# Altium project WS7.820.431.V01.PrjPCB
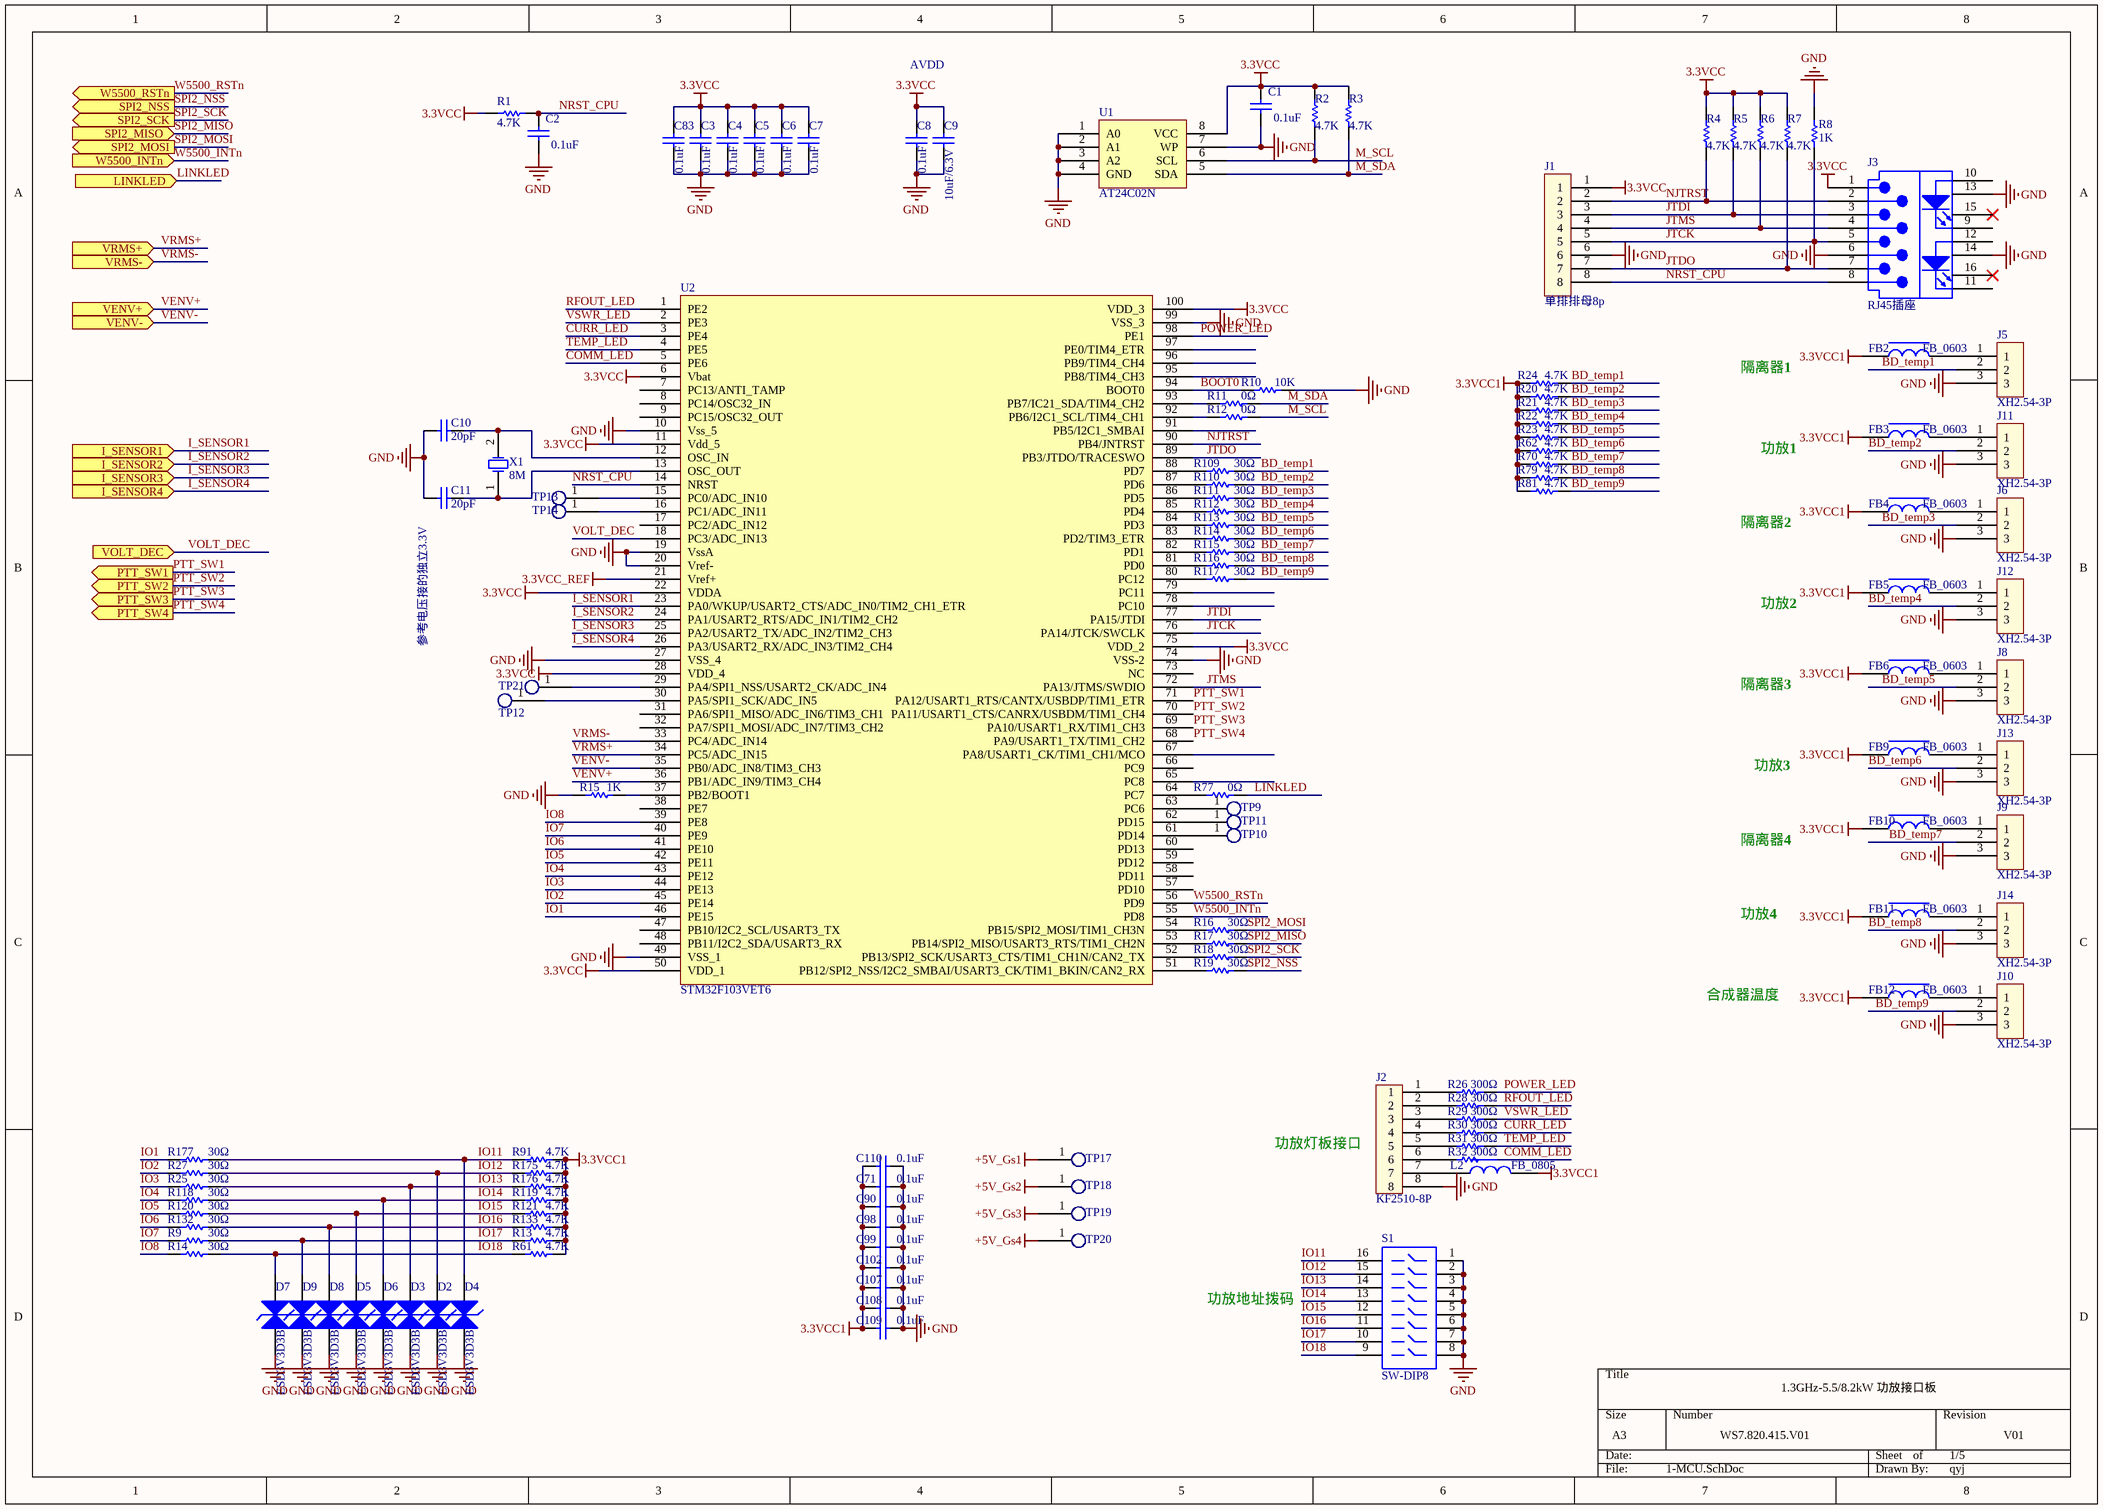
[diagram p0: 1-MCU.SchDoc]
4 sheets, 371 parts. Net scope: flat (ports and power ports of the same name join across sheets).
Board file: WS7.820.431.V01.PcbDoc
Sheets:
  1-MCU.SchDoc
  2-RJ45.SchDoc
  3-RF.SchDoc
  4-POWER.SchDoc

## Sheet 1-MCU.SchDoc
size A3

### Parts
C1  0.1uF  [C0603]
C2  0.1uF  [C0603]
C3  0.1uF  [C0603]
C4  0.1uF  [C0603]
C5  0.1uF  [C0603]
C6  0.1uF  [C0603]
C7  0.1uF  [C0603]
C8  0.1uF  [C0603]
C9  10uF/6.3V  [C0603]
C10  20pF  [C0603]
C11  20pF  [C0603]
C71  0.1uF  [C0603]
C83  0.1uF  [C0603]
C90  0.1uF  [C0603]
C98  0.1uF  [C0603]
C99  0.1uF  [C0603]
C102  0.1uF  [C0603]
C107  0.1uF  [C0603]
C108  0.1uF  [C0603]
C109  0.1uF  [C0603]
C110  0.1uF  [C0603]
D2  ESD3V3D3B  [SOD-323]
D3  ESD3V3D3B  [SOD-323]
D4  ESD3V3D3B  [SOD-323]
D5  ESD3V3D3B  [SOD-323]
D6  ESD3V3D3B  [SOD-323]
D7  ESD3V3D3B  [SOD-323]
D8  ESD3V3D3B  [SOD-323]
D9  ESD3V3D3B  [SOD-323]
FB2  FB_0603  [L0603]
FB3  FB_0603  [L0603]
FB4  FB_0603  [L0603]
FB5  FB_0603  [L0603]
FB6  FB_0603  [L0603]
FB9  FB_0603  [L0603]
FB10  FB_0603  [L0603]
FB11  FB_0603  [L0603]
FB12  FB_0603  [L0603]
J1  单排排母8p  [SIP8TM-2R54]
J2  KF2510-8P  [KF2510-8P -2R54-20R32x6R0-wanzhen]
J3  RJ45插座  [RJ45TH-1x1-2R54-LED]
J5  XH2.54-3P  [XH2.54mm-10R0x7R0--zhizhen]
J6  XH2.54-3P  [XH2.54mm-10R0x7R0--zhizhen]
J8  XH2.54-3P  [XH2.54mm-10R0x7R0--zhizhen]
J9  XH2.54-3P  [XH2.54mm-10R0x7R0--zhizhen]
J10  XH2.54-3P  [XH2.54mm-10R0x7R0--zhizhen]
J11  XH2.54-3P  [XH2.54mm-10R0x7R0--zhizhen]
J12  XH2.54-3P  [XH2.54mm-10R0x7R0--zhizhen]
J13  XH2.54-3P  [XH2.54mm-10R0x7R0--zhizhen]
J14  XH2.54-3P  [XH2.54mm-10R0x7R0--zhizhen]
L2  FB_0805  [L0805]
R1  4.7K  [R0603]
R2  4.7K  [R0603]
R3  4.7K  [R0603]
R4  4.7K  [R0603]
R5  4.7K  [R0603]
R6  4.7K  [R0603]
R7  4.7K  [R0603]
R8  1K  [R0603]
R9  30Ω  [R0603]
R10  10K  [R0603]
R11  0Ω  [R0603]
R12  0Ω  [R0603]
R13  4.7K  [R0603]
R14  30Ω  [R0603]
R15  1K  [R0603]
R16  30Ω  [R0603]
R17  30Ω  [R0603]
R18  30Ω  [R0603]
R19  30Ω  [R0603]
R20  4.7K  [R0603]
R21  4.7K  [R0603]
R22  4.7K  [R0603]
R23  4.7K  [R0603]
R24  4.7K  [R0603]
R25  30Ω  [R0603]
R26  300Ω  [R0603]
R27  30Ω  [R0603]
R28  300Ω  [R0603]
R29  300Ω  [R0603]
R30  300Ω  [R0603]
R31  300Ω  [R0603]
R32  300Ω  [R0603]
R61  4.7K  [R0603]
R62  4.7K  [R0603]
R70  4.7K  [R0603]
R77  0Ω  [R0603]
R79  4.7K  [R0603]
R81  4.7K  [R0603]
R91  4.7K  [R0603]
R109  30Ω  [R0603]
R110  30Ω  [R0603]
R111  30Ω  [R0603]
R112  30Ω  [R0603]
R113  30Ω  [R0603]
R114  30Ω  [R0603]
R115  30Ω  [R0603]
R116  30Ω  [R0603]
R117  30Ω  [R0603]
R118  30Ω  [R0603]
R119  4.7K  [R0603]
R120  30Ω  [R0603]
R121  4.7K  [R0603]
R132  30Ω  [R0603]
R133  4.7K  [R0603]
R175  4.7K  [R0603]
R176  4.7K  [R0603]
R177  30Ω  [R0603]
S1  SW-DIP8  [DIP-16-KEY]
TP9  TEST  [TP0R8]  (value not drawn)  (no BOM)
TP10  TEST  [TP0R8]  (value not drawn)  (no BOM)
TP11  TEST  [TP0R8]  (value not drawn)  (no BOM)
TP12  TEST  [TP0R8]  (value not drawn)  (no BOM)
TP13  TEST  [TP0R8]  (value not drawn)  (no BOM)
TP14  TEST  [TP0R8]  (value not drawn)  (no BOM)
TP17  (no value)  [TP2R54mm]
TP18  (no value)  [TP2R54mm]
TP19  (no value)  [TP2R54mm]
TP20  (no value)  [TP2R54mm]
TP21  TEST  [TP0R8]  (value not drawn)  (no BOM)
U1  AT24C02N  [SOIC8_1R27_3R9x4R9]
U2  STM32F103VET6  [LQFP100_0R5_14x14]
X1  8M  [CRY2SM-6R0x3R5]

### Ports
I_SENSOR1 (in), I_SENSOR2 (in), I_SENSOR3 (in), I_SENSOR4 (in), LINKLED (in), PTT_SW1 (out), PTT_SW2 (out), PTT_SW3 (out), PTT_SW4 (out), SPI2_MISO (in), SPI2_MOSI (out), SPI2_NSS (out), SPI2_SCK (out), VENV+ (in), VENV- (in), VOLT_DEC (in), VRMS+ (in), VRMS- (in), W5500_INTn (in), W5500_RSTn (out)

### Nets
3.3VCC: C1.2 C3.2 C4.2 C5.2 C6.2 C7.2 C8.2 C9.2 C83.2 J1.1 J3.1(TX+) R1.2 R2.2 R3.2 R4.2 R5.2 R6.2 R7.2 U1.8(VCC) U2.6(Vbat) U2.11(Vdd_5) U2.22(VDDA) U2.28(VDD_4) U2.50(VDD_1) U2.75(VDD_2) U2.100(VDD_3)
3.3VCC1: C71.1 C90.1 C98.1 C99.1 C102.1 C107.1 C108.1 C109.1 C110.1 FB2.1 FB3.1 FB4.1 FB5.1 FB6.1 FB9.1 FB10.1 FB11.1 FB12.1 L2.2 R13.1 R20.1 R21.1 R22.1 R23.1 R24.1 R61.1 R62.1 R70.1 R79.1 R81.1 R91.1 R119.1 R121.1 R133.1 R175.1 R176.1
3.3VCC_REF: U2.21(Vref+)
+5V_Gs1: TP17.1(TP)
+5V_Gs2: TP18.1(TP)
+5V_Gs3: TP19.1(TP)
+5V_Gs4: TP20.1(TP)
GND: C1.1 C2.1 C3.1 C4.1 C5.1 C6.1 C7.1 C8.1 C9.1 C10.2 C11.2 C71.2 C83.1 C90.2 C98.2 C99.2 C102.2 C107.2 C108.2 C109.2 C110.2 D2.2 D3.2 D4.2 D5.2 D6.2 D7.2 D8.2 D9.2 J1.6 J2.8 J3.6(RX-) J3.13 J3.14 J5.3 J6.3 J8.3 J9.3 J10.3 J11.3 J12.3 J13.3 J14.3 R8.1 R10.1 R15.1 S1.1 S1.2 S1.3 S1.4 S1.5 S1.6 S1.7 S1.8 U1.1(A0) U1.2(A1) U1.3(A2) U1.4(GND) U1.7(WP) U2.10(Vss_5) U2.19(VssA) U2.20(Vref-) U2.27(VSS_4) U2.49(VSS_1) U2.74(VSS-2) U2.99(VSS_3)
BD_temp1: J5.2 R24.2 R109.2
BD_temp2: J11.2 R20.2 R110.2
BD_temp3: J6.2 R21.2 R111.2
BD_temp4: J12.2 R22.2 R112.2
BD_temp5: J8.2 R23.2 R113.2
BD_temp6: J13.2 R62.2 R114.2
BD_temp7: J9.2 R70.2 R115.2
BD_temp8: J14.2 R79.2 R116.2
BD_temp9: J10.2 R81.2 R117.2
BOOT0: R10.2 U2.94(BOOT0)
COMM_LED: R32.2 U2.5(PE6)
CURR_LED: R30.2 U2.3(PE4)
I_SENSOR1: U2.23(PA0/WKUP/USART2_CTS/ADC_IN0/TIM2_CH1_ETR) ; port I_SENSOR1
I_SENSOR2: U2.24(PA1/USART2_RTS/ADC_IN1/TIM2_CH2) ; port I_SENSOR2
I_SENSOR3: U2.25(PA2/USART2_TX/ADC_IN2/TIM2_CH3) ; port I_SENSOR3
I_SENSOR4: U2.26(PA3/USART2_RX/ADC_IN3/TIM2_CH4) ; port I_SENSOR4
IO1: R177.2 U2.46(PE15)
IO2: R27.2 U2.45(PE14)
IO3: R25.2 U2.44(PE13)
IO4: R118.2 U2.43(PE12)
IO5: R120.2 U2.42(PE11)
IO6: R132.2 U2.41(PE10)
IO7: R9.2 U2.40(PE9)
IO8: R14.2 U2.39(PE8)
IO11: D4.1 R91.2 R177.1 S1.16
IO12: D2.1 R27.1 R175.2 S1.15
IO13: D3.1 R25.1 R176.2 S1.14
IO14: D6.1 R118.1 R119.2 S1.13
IO15: D5.1 R120.1 R121.2 S1.12
IO16: D8.1 R132.1 R133.2 S1.11
IO17: D9.1 R9.1 R13.2 S1.10
IO18: D7.1 R14.1 R61.2 S1.9
JTCK: J1.5 J3.5(NC) R8.2 U2.76(PA14/JTCK/SWCLK)
JTDI: J1.3 J3.3(RX+) R5.1 U2.77(PA15/JTDI)
JTDO: J1.7 J3.7(NC) R7.1 U2.89(PB3/JTDO/TRACESWO)
JTMS: J1.4 J3.4(NC) R6.1 U2.72(PA13/JTMS/SWDIO)
LINKLED: R77.2 ; port LINKLED
M_SCL: R2.1 R12.2 U1.6(SCL)
M_SDA: R3.1 R11.2 U1.5(SDA)
NJTRST: J1.2 J3.2(TX-) R4.1 U2.90(PB4/JNTRST)
NRST_CPU: C2.2 J1.8 J3.8(NC) R1.1 U2.14(NRST)
POWER_LED: R26.2 U2.98(PE1)
PTT_SW1: U2.71(PA12/USART1_RTS/CANTX/USBDP/TIM1_ETR) ; port PTT_SW1
PTT_SW2: U2.70(PA11/USART1_CTS/CANRX/USBDM/TIM1_CH4) ; port PTT_SW2
PTT_SW3: U2.69(PA10/USART1_RX/TIM1_CH3) ; port PTT_SW3
PTT_SW4: U2.68(PA9/USART1_TX/TIM1_CH2) ; port PTT_SW4
RFOUT_LED: R28.2 U2.1(PE2)
SPI2_MISO: R17.2 ; port SPI2_MISO
SPI2_MOSI: R16.2 ; port SPI2_MOSI
SPI2_NSS: R19.2 ; port SPI2_NSS
SPI2_SCK: R18.2 ; port SPI2_SCK
TEMP_LED: R31.2 U2.4(PE5)
VENV+: U2.36(PB1/ADC_IN9/TIM3_CH4) ; port VENV+
VENV-: U2.35(PB0/ADC_IN8/TIM3_CH3) ; port VENV-
VOLT_DEC: U2.18(PC3/ADC_IN13) ; port VOLT_DEC
VRMS+: U2.34(PC5/ADC_IN15) ; port VRMS+
VRMS-: U2.33(PC4/ADC_IN14) ; port VRMS-
VSWR_LED: R29.2 U2.2(PE3)
W5500_INTn: U2.55(PD8) ; port W5500_INTn
W5500_RSTn: U2.56(PD9) ; port W5500_RSTn
NetC10_1: C10.1 U2.12(OSC_IN) X1.2(OSC2)
NetC11_1: C11.1 U2.13(OSC_OUT) X1.1(OSC1)
NetFB2_2: FB2.2 J5.1
NetFB3_2: FB3.2 J11.1
NetFB4_2: FB4.2 J6.1
NetFB5_2: FB5.2 J12.1
NetFB6_2: FB6.2 J8.1
NetFB9_2: FB9.2 J13.1
NetFB10_2: FB10.2 J9.1
NetFB11_2: FB11.2 J14.1
NetFB12_2: FB12.2 J10.1
NetJ2_1: J2.1 R26.1
NetJ2_2: J2.2 R28.1
NetJ2_3: J2.3 R29.1
NetJ2_4: J2.4 R30.1
NetJ2_5: J2.5 R31.1
NetJ2_6: J2.6 R32.1
NetJ2_7: J2.7 L2.1
NetR11_1: R11.1 U2.93(PB7/IC21_SDA/TIM4_CH2)
NetR12_1: R12.1 U2.92(PB6/I2C1_SCL/TIM4_CH1)
NetR15_2: R15.2 U2.37(PB2/BOOT1)
NetR16_1: R16.1 U2.54(PB15/SPI2_MOSI/TIM1_CH3N)
NetR17_1: R17.1 U2.53(PB14/SPI2_MISO/USART3_RTS/TIM1_CH2N)
NetR18_1: R18.1 U2.52(PB13/SPI2_SCK/USART3_CTS/TIM1_CH1N/CAN2_TX)
NetR19_1: R19.1 U2.51(PB12/SPI2_NSS/I2C2_SMBAI/USART3_CK/TIM1_BKIN/CAN2_RX)
NetR77_1: R77.1 U2.64(PC7)
NetR109_1: R109.1 U2.88(PD7)
NetR110_1: R110.1 U2.87(PD6)
NetR111_1: R111.1 U2.86(PD5)
NetR112_1: R112.1 U2.85(PD4)
NetR113_1: R113.1 U2.84(PD3)
NetR114_1: R114.1 U2.83(PD2/TIM3_ETR)
NetR115_1: R115.1 U2.82(PD1)
NetR116_1: R116.1 U2.81(PD0)
NetR117_1: R117.1 U2.80(PC12)
NetTP9_1: TP9.1(TP) U2.63(PC6)
NetTP10_1: TP10.1(TP) U2.61(PD14)
NetTP11_1: TP11.1(TP) U2.62(PD15)
NetTP12_1: TP12.1(TP) U2.30(PA5/SPI1_SCK/ADC_IN5)
NetTP13_1: TP13.1(TP) U2.15(PC0/ADC_IN10)
NetTP14_1: TP14.1(TP) U2.16(PC1/ADC_IN11)
NetTP21_1: TP21.1(TP) U2.29(PA4/SPI1_NSS/USART2_CK/ADC_IN4)

Not connected (* = marked no-connect by the designer): J3 9(K1) 10(A1) 11(K2) 12(A2) 15* 16*; U2 7(PC13/ANTI_TAMP) 8(PC14/OSC32_IN) 9(PC15/OSC32_OUT) 17(PC2/ADC_IN12) 31(PA6/SPI1_MISO/ADC_IN6/TIM3_CH1) 32(PA7/SPI1_MOSI/ADC_IN7/TIM3_CH2) 38(PE7) 47(PB10/I2C2_SCL/USART3_TX) 48(PB11/I2C2_SDA/USART3_RX) 57(PD10) 58(PD11) 59(PD12) 60(PD13) 65(PC8) 66(PC9) 67(PA8/USART1_CK/TIM1_CH1/MCO) 73(NC) 78(PC10) 79(PC11) 91(PB5/I2C1_SMBAI) 95(PB8/TIM4_CH3) 96(PB9/TIM4_CH4) 97(PE0/TIM4_ETR)

### Notes on the sheet
- AVDD
- 隔离器1
- 功放1
- 隔离器2
- 参考电压接的独立3.3V
- 功放2
- 隔离器3
- 功放3
- 隔离器4
- 功放4
- 合成器温度
- 功放灯板接口
- 功放地址拨码
- 1.3GHz-5.5/8.2kW 功放接口板
- WS7.820.415.V01
- 1/5
- V01
- qyj

### Library data of the parts
C1-C8 C83 = 0.1uF贴片电容: 贴片电容_GRM188R71H104KA01D_0.1uF±10%,50V,0603; code: 01010045
C9 = 10uF贴片电容: 贴片电容_GRM188R60J106ME47D_10uF±20%,6.3V,0603; code: 01010037
C10 C11 = 20pF贴片电容: 贴片电容_GRM188C1H200JB01D_20pF±5%,50V,0603; code: 01010035
C71 C90 C98 C99 C102 C107-C110 = 0.1uF: GRM188R71H104KA01D; MPN: MURATA; WSPN: 01010045
D2-D9 = ESD5B5.0ST1G: ESD_ESD3V3D3B_SOD-323,3.3V,双管
FB2-FB6 FB9-FB12 = 0603贴片磁珠: 贴片磁珠_100R,0603; code: 0103016
J1 = 8p-2.54单排母座: 连接器_单排排母座8p_直插,间距2.54mm; MPN: WS; code: 01090052
J2 = KF2510-8P弯针: 连接器_KF2510-8P_90°弯针,间距2.54mm
J3 = RJ45弯脚带灯: RJ45插座_1*1,带左黄右绿灯,弯脚; MPN: 朱迅; code: 01090042
J5 J6 J8-J14 = XH2.54-3P: 连接器_XH2.54-3P_弯针,间距2.54mm
L2 = 0805贴片磁珠: 贴片磁珠_600R,0805; code: 01030023
R1-R7 R13 R20-R24 R61 R62 R70 R79 R81 R91 R119 R121 R133 R175 R176 = 4.7K贴片电阻: 贴片电阻_4.7K±5%,0603; code: 01020012
R8 R15 = 1K贴片电阻: 贴片电阻_1K±5%,0603; code: 01020082
R9 R14 R25 R27 R118 R120 R132 R177 = 0Ω贴片电阻: 贴片电阻_30Ω±5%,0603; code: 01020010
R10 = 10K贴片电阻: 贴片电阻_10K±5%,0603; code: 01020011
R11 R12 R77 = 0Ω贴片电阻: 贴片电阻_0Ω±5%,0603; code: 01020010
R16-R19 R109-R117 = 30Ω贴片电阻: 贴片电阻_30Ω±5%,0603; code: 01020108
R26 R28-R32 = 300Ω贴片电阻: 贴片电阻_300Ω±5%,0603; code: 01020008
S1 = SW-DIP8: 4009 Series DIP Switch, Raised actuator; Published: 24-Mar-1999; LatestRevisionDate: 17-Dec-2003; LatestRevisionNote: PCB Footprint replaced.; PackageReference: DIP-16-KEY; Publisher: Altium Limited; PackageDescription: DIP; 16 Leads; Row Spacing 7.62 mm; Pitch 2.54 mm; ComponentLink1Description: Manufacturer Link; ComponentLink1URL: http://www.oupiin.com/prodindx.html#Headers
TP9-TP14 TP21 = TP0.8mm: 表贴测试点0.8mm
TP17-TP20 = TP2mm: 表贴测试点1mm
U1 = AT24C02N: EEPROM_AT24C02N_SOIC8; Maker: ATMEL; code: 01060068
U2 = STM32F103VET: MCU_STM32F103VET6_32 bit, LQFP100; Maker: ST; code: 01060037
X1 = 8M贴片无源晶体: 贴片无源晶体_8MHz,封装6035; code: 03050006

## Sheet 2-RJ45.SchDoc
size A3
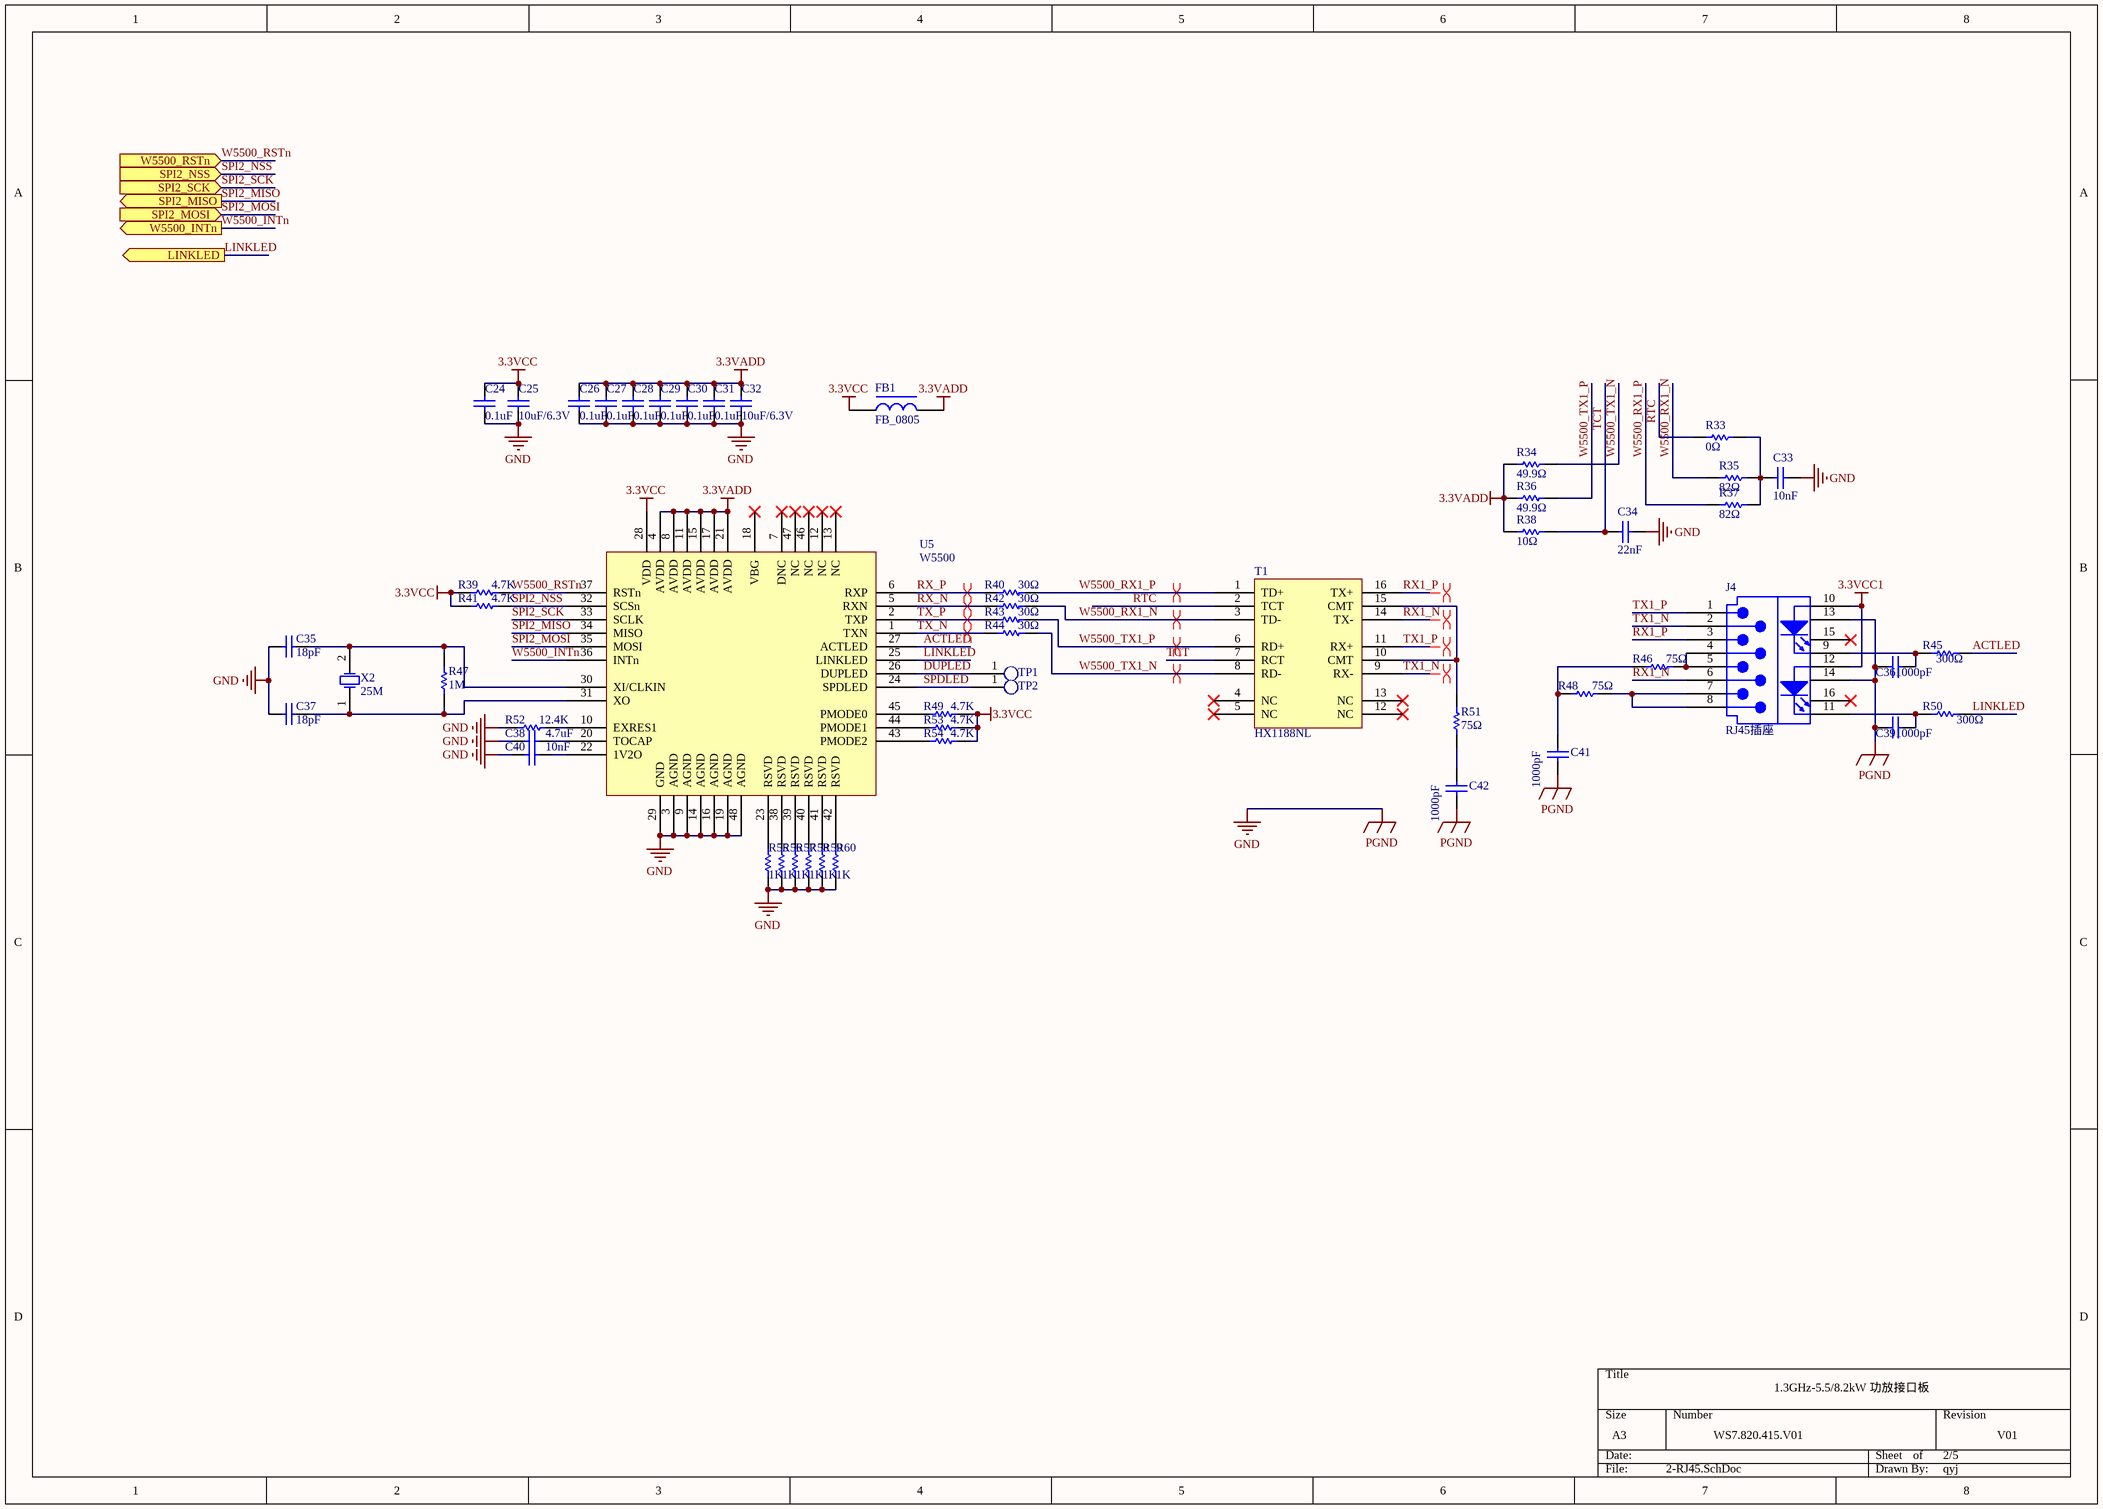
[diagram p1: 2-RJ45.SchDoc]

### Parts
C24  0.1uF  [C0603]
C25  10uF/6.3V  [C0603]
C26  0.1uF  [C0603]
C27  0.1uF  [C0603]
C28  0.1uF  [C0603]
C29  0.1uF  [C0603]
C30  0.1uF  [C0603]
C31  0.1uF  [C0603]
C32  10uF/6.3V  [C0603]
C33  10nF  [C0603]
C34  22nF  [C0603]
C35  18pF  [C0603]
C36  1000pF  [C0603]
C37  18pF  [C0603]
C38  4.7uF  [C0603]
C39  1000pF  [C0603]
C40  10nF  [C0603]
C41  1000pF  [C1206]
C42  1000pF  [C1206]
FB1  FB_0805  [L0805]
J4  RJ45插座  [RJ45TH-1x1-2R54-LED]
R33  0Ω  [R0603]
R34  49.9Ω  [R0603]
R35  82Ω  [R0603]
R36  49.9Ω  [R0603]
R37  82Ω  [R0603]
R38  10Ω  [R0603]
R39  4.7K  [R0603]
R40  30Ω  [R0603]
R41  4.7K  [R0603]
R42  30Ω  [R0603]
R43  30Ω  [R0603]
R44  30Ω  [R0603]
R45  300Ω  [R0603]
R46  75Ω  [R0805]
R47  1M  [R0603]
R48  75Ω  [R0805]
R49  4.7K  [R0603]
R50  300Ω  [R0603]
R51  75Ω  [R1206]
R52  12.4K  [R0603]
R53  4.7K  [R0603]
R54  4.7K  [R0603]
R55  1K  [R0603]
R56  1K  [R0603]
R57  1K  [R0603]
R58  1K  [R0603]
R59  1K  [R0603]
R60  1K  [R0603]
T1  HX1188NL  [SOP16-1R27-7R11x12R7]
TP1  TEST  [TP0R8]  (value not drawn)
TP2  TEST  [TP0R8]  (value not drawn)
U5  W5500  [TQFN48-0R5-7X7]
X2  25M  [CRY2SM-6R0x3R5]

### Ports
LINKLED (out), SPI2_MISO (out), SPI2_MOSI (in), SPI2_NSS (in), SPI2_SCK (in), W5500_INTn (out), W5500_RSTn (in)

### Nets
3.3VADD: C26.2 C27.2 C28.2 C29.2 C30.2 C31.2 C32.2 FB1.2 R34.2 R36.2 R38.2 U5.4(AVDD) U5.8(AVDD) U5.11(AVDD) U5.15(AVDD) U5.17(AVDD) U5.21(AVDD)
3.3VCC: C24.2 C25.2 FB1.1 R39.2 R41.2 R49.2 R53.2 R54.2 U5.28(VDD)
3.3VCC1: J4.10(A1) J4.12(A2)
GND: C24.1 C25.1 C26.1 C27.1 C28.1 C29.1 C30.1 C31.1 C32.1 C33.1 C34.1 C35.1 C36.1 C37.1 C38.1 C39.1 C40.1 C41.1 C42.1 J4.13 J4.14 R52.1 R55.1 R56.1 R57.1 R58.1 R59.1 R60.1 U5.3(AGND) U5.9(AGND) U5.14(AGND) U5.16(AGND) U5.19(AGND) U5.29(GND) U5.48(AGND)  [also labelled PGND]
ACTLED: R45.2 U5.27(ACTLED)
DUPLED: TP1.1(TP) U5.26(DUPLED)
LINKLED: R50.2 U5.25(LINKLED) ; port LINKLED
RTC: R33.2 T1.2(TCT)
RX1_N: J4.6(RX-) T1.14(TX-)
RX1_P: J4.3(RX+) T1.16(TX+)
RX_N: R42.1 U5.5(RXN)
RX_P: R40.1 U5.6(RXP)
SPDLED: TP2.1(TP) U5.24(SPDLED)
SPI2_MISO: U5.34(MISO) ; port SPI2_MISO
SPI2_MOSI: U5.35(MOSI) ; port SPI2_MOSI
SPI2_NSS: R41.1 U5.32(SCSn) ; port SPI2_NSS
SPI2_SCK: U5.33(SCLK) ; port SPI2_SCK
TCT: C34.2 R38.1 T1.7(RCT)
TX1_N: J4.2(TX-) T1.9(RX-)
TX1_P: J4.1(TX+) T1.11(RX+)
TX_N: R44.1 U5.1(TXN)
TX_P: R43.1 U5.2(TXP)
W5500_INTn: U5.36(INTn) ; port W5500_INTn
W5500_RSTn: R39.1 U5.37(RSTn) ; port W5500_RSTn
W5500_RX1_N: R35.2 R42.2 T1.3(TD-)
W5500_RX1_P: R37.2 R40.2 T1.1(TD+)
W5500_TX1_N: R34.1 R44.2 T1.8(RD-)
W5500_TX1_P: R36.1 R43.2 T1.6(RD+)
NetC33_2: C33.2 R33.1 R35.1 R37.1
NetC35_2: C35.2 R47.2 U5.30(XI/CLKIN) X2.2(OSC2)
NetC36_2: C36.2 J4.9(K1) R45.1
NetC37_2: C37.2 R47.1 U5.31(XO) X2.1(OSC1)
NetC38_2: C38.2 U5.20(TOCAP)
NetC39_2: C39.2 J4.11(K2) R50.1
NetC40_2: C40.2 U5.22(1V2O)
NetC41_2: C41.2 R46.1 R48.1
NetC42_2: C42.2 R51.1
NetJ4_4: J4.4(NC) J4.5(NC) R46.2
NetJ4_7: J4.7(NC) J4.8(NC) R48.2
NetR49_1: R49.1 U5.45(PMODE0)
NetR51_2: R51.2 T1.10(CMT) T1.15(CMT)
NetR52_2: R52.2 U5.10(EXRES1)
NetR53_1: R53.1 U5.44(PMODE1)
NetR54_1: R54.1 U5.43(PMODE2)
NetR55_2: R55.2 U5.23(RSVD)
NetR56_2: R56.2 U5.38(RSVD)
NetR57_2: R57.2 U5.39(RSVD)
NetR58_2: R58.2 U5.40(RSVD)
NetR59_2: R59.2 U5.41(RSVD)
NetR60_2: R60.2 U5.42(RSVD)

Not connected (* = marked no-connect by the designer): J4 15* 16*; T1 4(NC)* 5(NC)* 12(NC)* 13(NC)*; U5 7(DNC)* 12(NC)* 13(NC)* 18(VBG)* 46(NC)* 47(NC)*

### Layout directives
differential pair: RX1_N, RX1_P, RX_N, RX_P, TX1_N, TX1_P, TX_N, TX_P, W5500_RX1_N, W5500_RX1_P, W5500_TX1_N, W5500_TX1_P

### Notes on the sheet
- 1.3GHz-5.5/8.2kW 功放接口板
- WS7.820.415.V01
- 2/5
- V01
- qyj

### Library data of the parts
C24 C26-C31 = 0.1uF贴片电容: as C1 on sheet 1-MCU
C25 C32 = 10uF贴片电容: as C9 on sheet 1-MCU
C33 C40 = 0.1uF贴片电容: C0603C103K5RAC_10nF±10%,50V,0603; MPN: KEMET; code: 01010218
C34 = 27nF贴片电容: 贴片电容_22nF±5%,50V,0603; code: 01010054
C35 C37 = 18pF贴片电容: 贴片电容_GRM1885C1H180JA01D_18pF±5%,50V,0603; code: 01010102
C36 C39 = 1000pF贴片电容: 贴片电容_GRM188R71H102KA01_1000pF±10%,50V,0603; code: 01010093
C38 = 1uF贴片电容: GRM188R61C475K_4.7uF±10%,16V,0603; MPN: Murata; code: 01010098
C41 C42 = 10uF贴片电容: 贴片电容_C1206C102J5GAC _1000pF±5%,50V,1206; MPN: KEMET; code: 01010213
FB1 = 0805贴片磁珠: 贴片磁珠_600R,0805; code: 01030023
J4 = RJ45弯脚带灯: as J3 on sheet 1-MCU
R33 = 0Ω贴片电阻: 贴片电阻_0Ω±5%,0603; code: 01020010
R34 R36 = 51Ω贴片电阻: 贴片电阻_49.9Ω±1%,0603; code: 01020126
R35 R37 = 51Ω贴片电阻: 贴片电阻_82Ω±1%,0603; code: 01020196
R38 = 10Ω贴片电阻: 贴片电阻_10Ω±5%,0603; code: 01020104
R39 R41 R49 R53 R54 = 4.7K贴片电阻: 贴片电阻_4.7K±5%,0603; code: 01020012
R40 R42-R44 = 30Ω贴片电阻: 贴片电阻_30Ω±5%,0603; code: 01020108
R45 R50 = 300Ω贴片电阻: 贴片电阻_300Ω±5%,0603; code: 01020008
R46 R48 = 75Ω贴片电阻: 贴片电阻_75Ω±5%,0805; code: 01020068
R47 = 1M贴片电阻: 贴片电阻_1M±5%,0603; code: 01020093
R51 = 75Ω贴片电阻: 贴片电阻_75Ω±5%,1206; code: 01020197
R52 = 12K贴片电阻: 贴片电阻_12.4K±1%,0603
R55-R60 = 1K贴片电阻: 贴片电阻_1K±5%,0603; code: 01020082
T1 = HX1188NL: 网络变压器_HX1188NL_百兆,SOIC16; code: 01060114
TP1 TP2 = TP0.8mm: 表贴测试点0.8mm
U5 = W5500: 以太网控制器_W5500_LQFP48; code: 01060113
X2 = 25M贴片无源晶体: 贴片无源晶体_25MHz,30ppm,6035封装; code: 03050012

## Sheet 3-RF.SchDoc
size A2
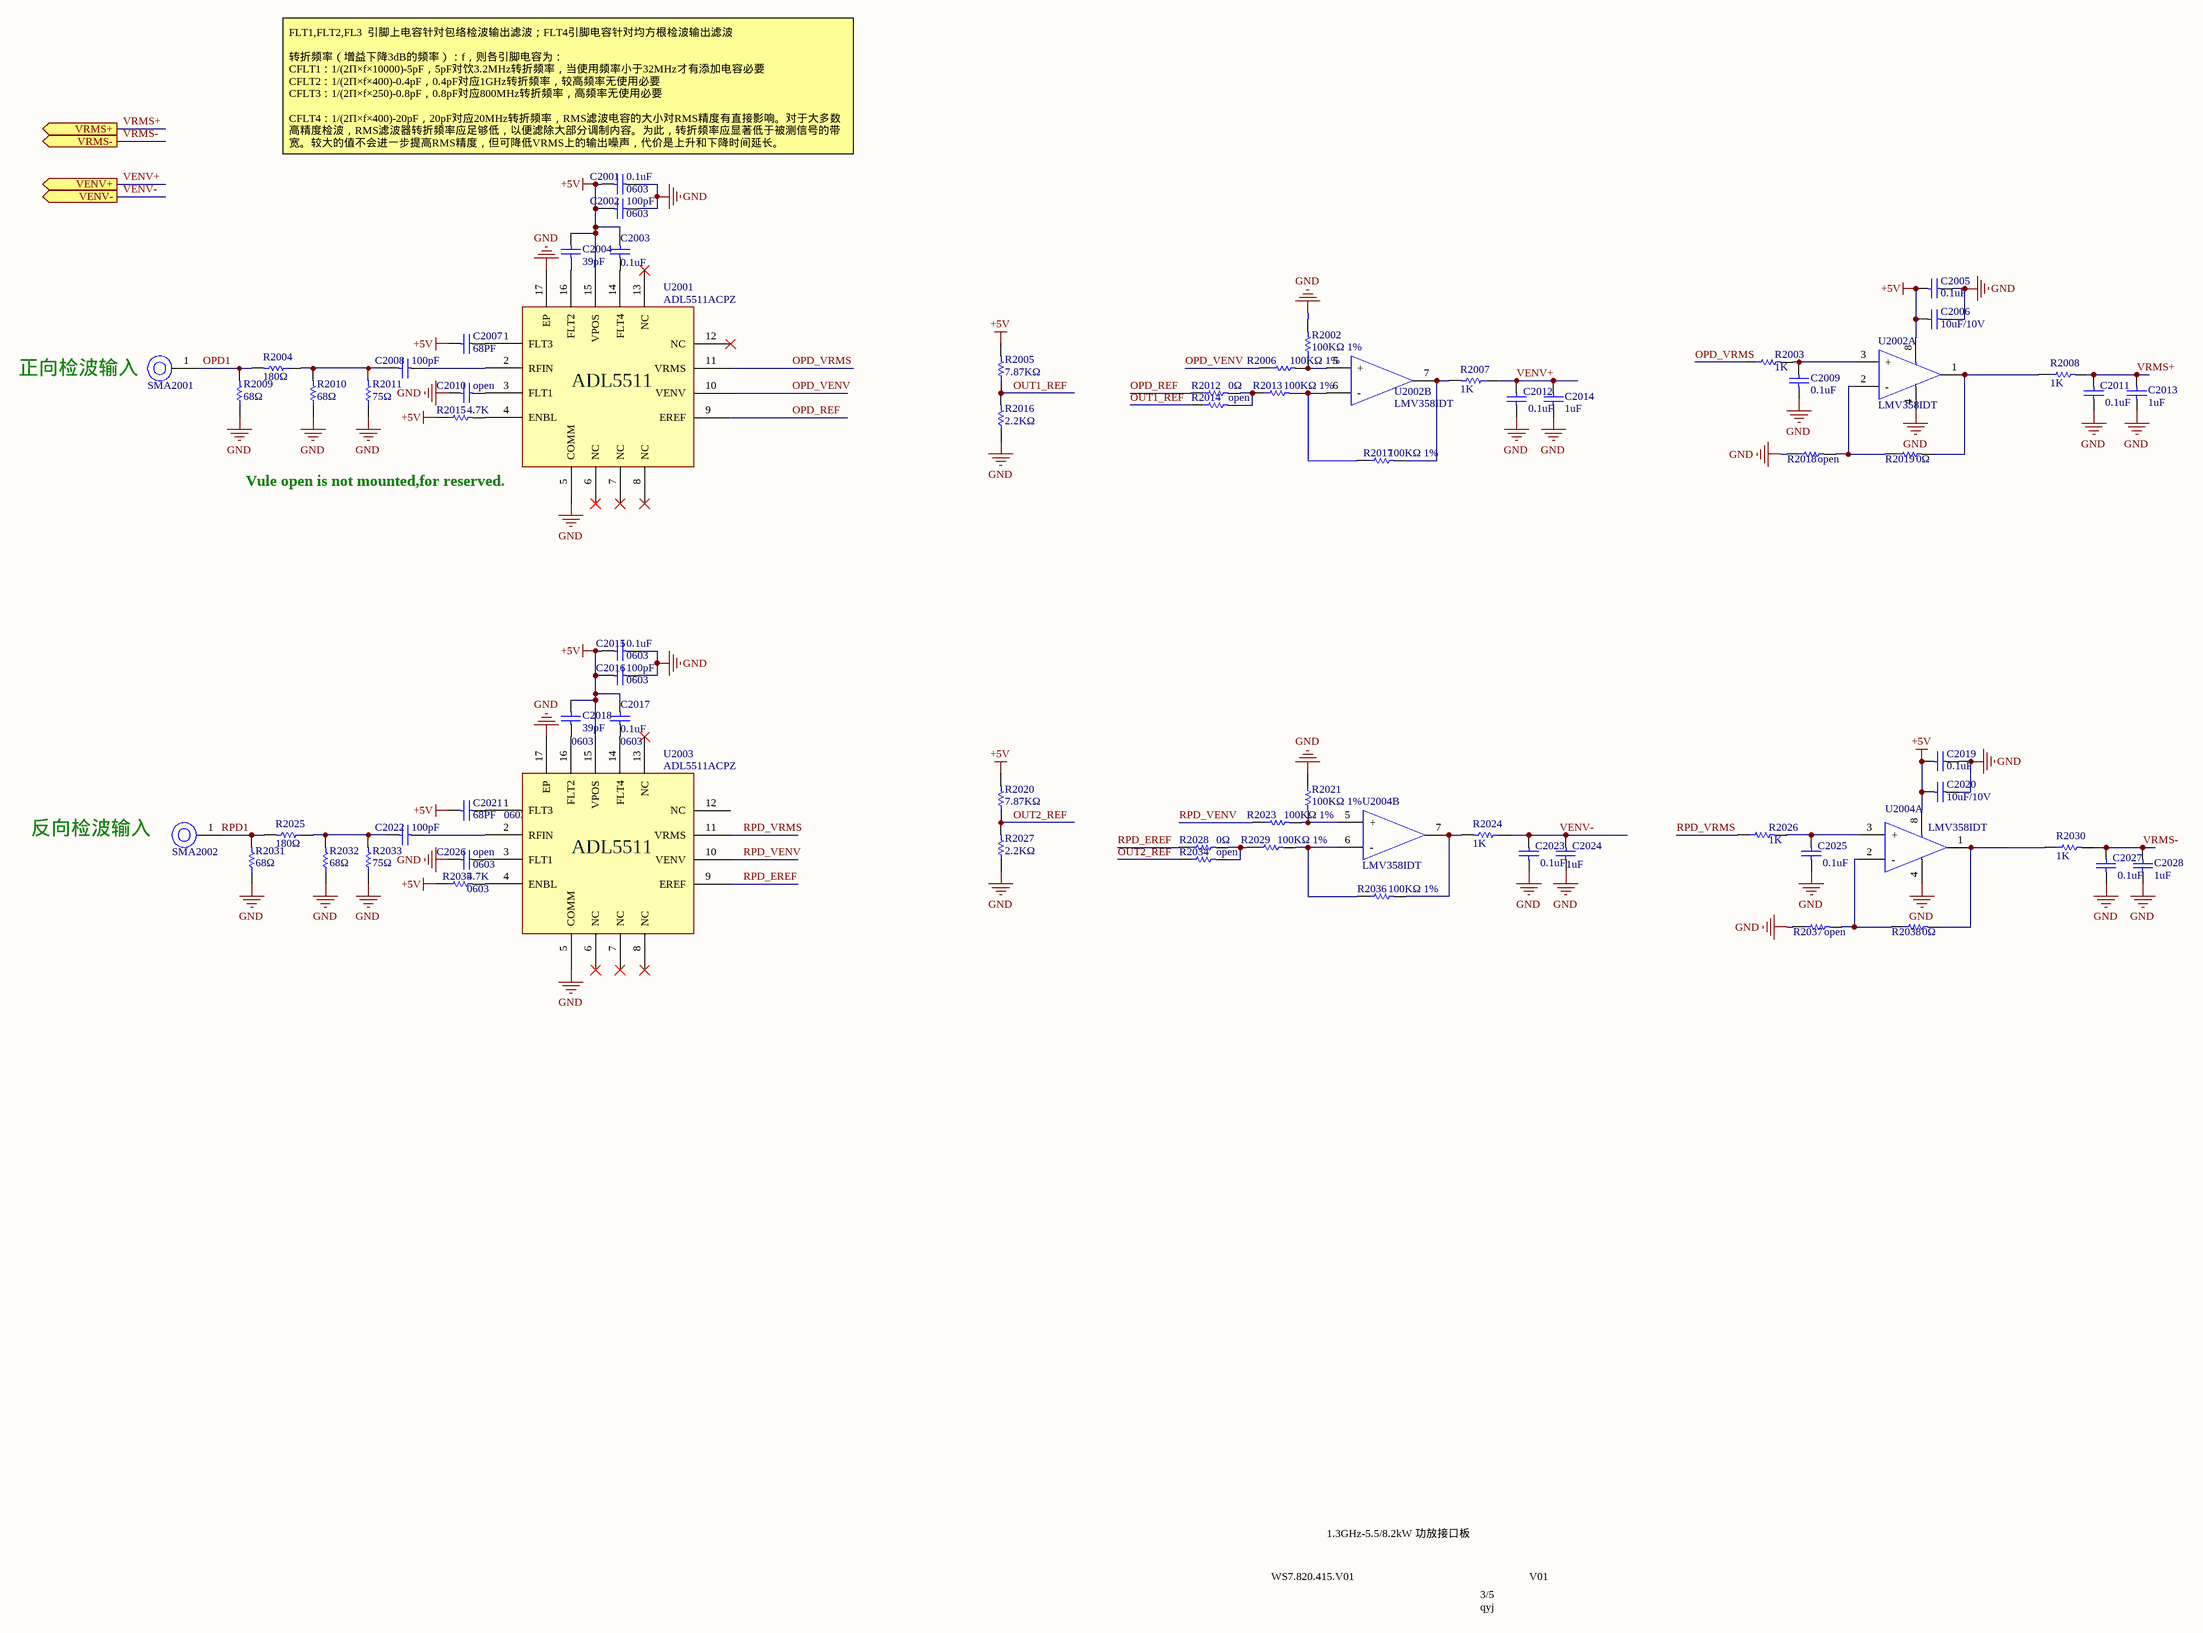
[diagram p2: 3-RF.SchDoc]

### Parts
C2001  0.1uF  [C0603]
C2002  100pF  [C0603]
C2003  0.1uF  [C0603]
C2004  39pF  [C0603]  (no BOM)
C2005  0.1uF  [C0603]
C2006  10uF/10V  [C0805]
C2007  68PF  [C0603]  (no BOM)
C2008  100pF  [C0805]
C2009  0.1uF  [C0603]
C2010  open  [C0603]  (no BOM)
C2011  0.1uF  [C0603]
C2012  0.1uF  [C0603]
C2013  1uF  [C0603]
C2014  1uF  [C0603]
C2015  0.1uF  [C0603]
C2016  100pF  [C0603]
C2017  0.1uF  [C0603]
C2018  39pF  [C0603]  (no BOM)
C2019  0.1uF  [C0603]
C2020  10uF/10V  [C0805]
C2021  68PF  [C0603]  (no BOM)
C2022  100pF  [C0805]
C2023  0.1uF  [C0603]
C2024  1uF  [C0603]
C2025  0.1uF  [C0603]
C2026  open  [C0603]  (no BOM)
C2027  0.1uF  [C0603]
C2028  1uF  [C0603]
R2002  100KΩ 1%  [R0603]
R2003  1K  [R0603]
R2004  180Ω  [R1206]
R2005  7.87KΩ  [R0603]  (no BOM)
R2006  100KΩ 1%  [R0603]
R2007  1K  [R0603]
R2008  1K  [R0603]
R2009  68Ω  [R1206]
R2010  68Ω  [R1206]
R2011  75Ω  [R0805]
R2012  0Ω  [R0603]
R2013  100KΩ 1%  [R0603]
R2014  open  [R0603]  (no BOM)
R2015  4.7K  [R0603]
R2016  2.2KΩ  [R0603]  (no BOM)
R2017  100KΩ 1%  [R0603]
R2018  open  [R0603]  (no BOM)
R2019  0Ω  [R0603]
R2020  7.87KΩ  [R0603]  (no BOM)
R2021  100KΩ 1%  [R0603]
R2023  100KΩ 1%  [R0603]
R2024  1K  [R0603]
R2025  180Ω  [R1206]
R2026  1K  [R0603]
R2027  2.2KΩ  [R0603]  (no BOM)
R2028  0Ω  [R0603]
R2029  100KΩ 1%  [R0603]
R2030  1K  [R0603]
R2031  68Ω  [R1206]
R2032  68Ω  [R1206]
R2033  75Ω  [R0805]
R2034  open  [R0603]  (no BOM)
R2035  4.7K  [R0603]
R2036  100KΩ 1%  [R0603]
R2037  open  [R0603]  (no BOM)
R2038  0Ω  [R0603]
SMA2001  SMA-50KFD-4  [SMA-50KFD-4]  (value not drawn)
SMA2002  SMA-50KFD-4  [SMA-50KFD-4]  (value not drawn)
U2001  ADL5511ACPZ  [QFN16_0R50_3X3]
U2002  LMV358IDT  [SOIC8_1R27_3R9x4R9]  (parts A,B of 2)
U2003  ADL5511ACPZ  [QFN16_0R50_3X3]
U2004  LMV358IDT  [SOIC8_1R27_3R9x4R9]  (parts A,B of 2)

### Ports
VENV+ (out), VENV- (out), VRMS+ (out), VRMS- (out)

### Nets
+5V: C2001.2 C2002.1 C2003.2 C2004.2 C2005.1 C2006.1 C2007.1 C2015.2 C2016.1 C2017.2 C2018.2 C2019.1 C2020.1 C2021.1 R2005.2 R2015.1 R2020.2 R2035.1 U2001.15(VPOS) U2002.8 U2003.15(VPOS) U2004.8
GND: C2001.1 C2002.2 C2005.2 C2006.2 C2009.1 C2010.1 C2011.1 C2012.1 C2013.1 C2014.1 C2015.1 C2016.2 C2019.2 C2020.2 C2023.1 C2024.1 C2025.1 C2026.1 C2027.1 C2028.1 R2002.2 R2009.1 R2010.1 R2011.1 R2016.1 R2018.1 R2021.1 R2027.1 R2031.1 R2032.1 R2033.1 R2037.1 U2001.5(COMM) U2001.17(EP) U2002.4 U2003.5(COMM) U2003.17(EP) U2004.4
OPD1: R2004.2 R2009.2 SMA2001.1(Sig)
OPD_REF: R2012.1 U2001.9(EREF)
OPD_VENV: R2006.1 U2001.10(VENV)
OPD_VRMS: R2003.1 U2001.11(VRMS)
OUT1_REF: R2005.1 R2014.1 R2016.2
OUT2_REF: R2020.1 R2027.2 R2034.1
RPD1: R2025.2 R2031.2 SMA2002.1(Sig)
RPD_EREF: R2028.1 U2003.9(EREF)
RPD_VENV: R2023.1 U2003.10(VENV)
RPD_VRMS: R2026.1 U2003.11(VRMS)
VENV+: C2012.2 C2014.2 R2007.1 ; port VENV+
VENV-: C2023.2 C2024.2 R2024.1 ; port VENV-
VRMS+: C2011.2 C2013.2 R2008.2 ; port VRMS+
VRMS-: C2027.2 C2028.2 R2030.2 ; port VRMS-
NetC2003_1: C2003.1 U2001.14(FLT4)
NetC2004_1: C2004.1 U2001.16(FLT2)
NetC2007_2: C2007.2 U2001.1(FLT3)
NetC2008_1: C2008.1 R2004.1 R2010.2 R2011.2
NetC2008_2: C2008.2 U2001.2(RFIN)
NetC2009_2: C2009.2 R2003.2 U2002.3(+)
NetC2010_2: C2010.2 U2001.3(FLT1)
NetC2017_1: C2017.1 U2003.14(FLT4)
NetC2018_1: C2018.1 U2003.16(FLT2)
NetC2021_2: C2021.2 U2003.1(FLT3)
NetC2022_1: C2022.1 R2025.1 R2032.2 R2033.2
NetC2022_2: C2022.2 U2003.2(RFIN)
NetC2025_2: C2025.2 R2026.2 U2004.3(+)
NetC2026_2: C2026.2 U2003.3(FLT1)
NetR2002_1: R2002.1 R2006.2 U2002.5(+)
NetR2007_2: R2007.2 R2017.2 U2002.7
NetR2008_1: R2008.1 R2019.2 U2002.1
NetR2012_2: R2012.2 R2013.1 R2014.2
NetR2013_2: R2013.2 R2017.1 U2002.6(-)
NetR2015_2: R2015.2 U2001.4(ENBL)
NetR2018_2: R2018.2 R2019.1 U2002.2(-)
NetR2021_2: R2021.2 R2023.2 U2004.5(+)
NetR2024_2: R2024.2 R2036.2 U2004.7
NetR2028_2: R2028.2 R2029.1 R2034.2
NetR2029_2: R2029.2 R2036.1 U2004.6(-)
NetR2030_1: R2030.1 R2038.2 U2004.1
NetR2035_2: R2035.2 U2003.4(ENBL)
NetR2037_2: R2037.2 R2038.1 U2004.2(-)

Not connected (* = marked no-connect by the designer): U2001 6(NC)* 7(NC)* 8(NC)* 12(NC)* 13(NC)*; U2003 6(NC)* 7(NC)* 8(NC)* 12(NC) 13(NC)*

### Notes on the sheet
- (near C2001) FLT1,FLT2,FL3  引脚上电容针对包络检波输出滤波；FLT4引脚电容针对均方根检波输出滤波
  转折频率（增益下降3dB的频率）：f，则各引脚电容为：
  CFLT1：1/(2Π×f×10000)-5pF，5pF对饮3.2MHz转折频率，当使用频率小于32MHz才有添加电容必要
  CFLT2：1/(2Π×f×400)-0.4pF，0.4pF对应1GHz转折频率，较高频率无使用必要
  CFLT3：1/(2Π×f×250)-0.8pF，0.8pF对应800MHz转折频率，高频率无使用必要
  CFLT4：1/(2Π×f×400)-20pF，20pF对应20MHz转折频率，RMS滤波电容的大小对RMS精度有直接影响。对于大多数高精度检波，RMS滤波器转折频率应足够低，以便滤除大部分调制内容。为此，转折频率应显著低于被测信号的带宽。较大的值不会进一步提高RMS精度，但可降低VRMS上的输出噪声，代价是上升和下降时间延长。
- (near C2001) 0603
- (near C2002) 0603
- 正向检波输入
- (near U2001) Vule open is not mounted,for reserved.
- (near C2015) 0603
- (near C2016) 0603
- (near C2018) 0603
- (near C2017) 0603
- 反向检波输入
- (near U2003) 0603
- (near R2035) 0603
- (near C2026) 0603
- 1.3GHz-5.5/8.2kW 功放接口板
- WS7.820.415.V01
- 3/5
- V01
- qyj
- (in symbol ADL5511ACPZ) ADL5511

### Library data of the parts
C2001 C2003 C2005 C2009 C2011 C2012 C2015 C2017 C2019 C2023 C2025 C2027 = 0.1uF贴片电容: as C1 on sheet 1-MCU
C2002 C2016 = 1000pF贴片电容: 贴片电容_100pF±10%,50V,0603
C2004 C2018 = 10pF贴片电容: GRM1885C1H390JA01D_39pF±5%,50V,0603; code: 01010157
C2006 C2020 = 10uF贴片电容: 贴片电容_GRM21BR61A106KE19L_10uF±10%,10V,0805; code: 01010036
C2007 C2021 = 10pF贴片电容: 贴片电容_GRM1885C1H680JA01D_0603,68PF,50V,±5％,COG; MPN: Murata; code: 01010034
C2008 C2022 = 100pF贴片电容: 贴片电容_GRM2165C1H101JA01D_100pF±5%,50V,0805; code: 01010043
C2010 C2026 = 1000pF贴片电容: as C36 on sheet 2-RJ45
C2013 C2028 = 10uF贴片电容: as C9 on sheet 1-MCU
C2014 C2024 = 10uF贴片电容: code: 01010037
R2002 R2006 R2013 R2017 R2021 R2023 R2029 R2036 = 430Ω贴片电阻: code: 01020118
R2003 R2026 = 1K贴片电阻: 贴片电阻_1K±5%,0603; code: 01020082
R2004 R2025 = 56Ω贴片电阻: 贴片电阻_1206,180Ω,±5％
R2005 R2020 = 0Ω贴片电阻: 0603,7.87KΩ,±1％; code: 01020010
R2007 R2008 R2024 R2030 = 10K贴片电阻: 贴片电阻_1K±5%,0603
R2009 R2010 R2031 R2032 = 56Ω贴片电阻: 贴片电阻_68Ω±5%,1206
R2011 R2033 = 75Ω贴片电阻: 贴片电阻_75Ω±5%,0805; code: 01020068
R2012 R2014 R2019 R2028 R2034 R2038 = 0Ω贴片电阻: 贴片电阻_0Ω±5%,0603; code: 01020010
R2015 R2035 = 4.7K贴片电阻: 贴片电阻_4.7K±5%,0603; code: 01020012
R2016 R2027 = 0Ω贴片电阻: 0603,2.2KΩ,±1％; code: 01020010
R2018 R2037 = 0Ω贴片电阻
SMA2001 SMA2002 = SMA-50KFD-4: 射频同轴连接器_SMA-50KFD-4; code: 03100009
U2001 U2003 = ADL5511ACPZ: 检波器_ADL5511ACPZ_DC~6GHz,LFCSP16; code: 01060108
U2002 = OP284: Maker: TI; code: 01060201
U2004 = LM358: 运算放大器_LM358_SOIC8; Maker: MOTOROLA; code: 01060025

## Sheet 4-POWER.SchDoc
size A3
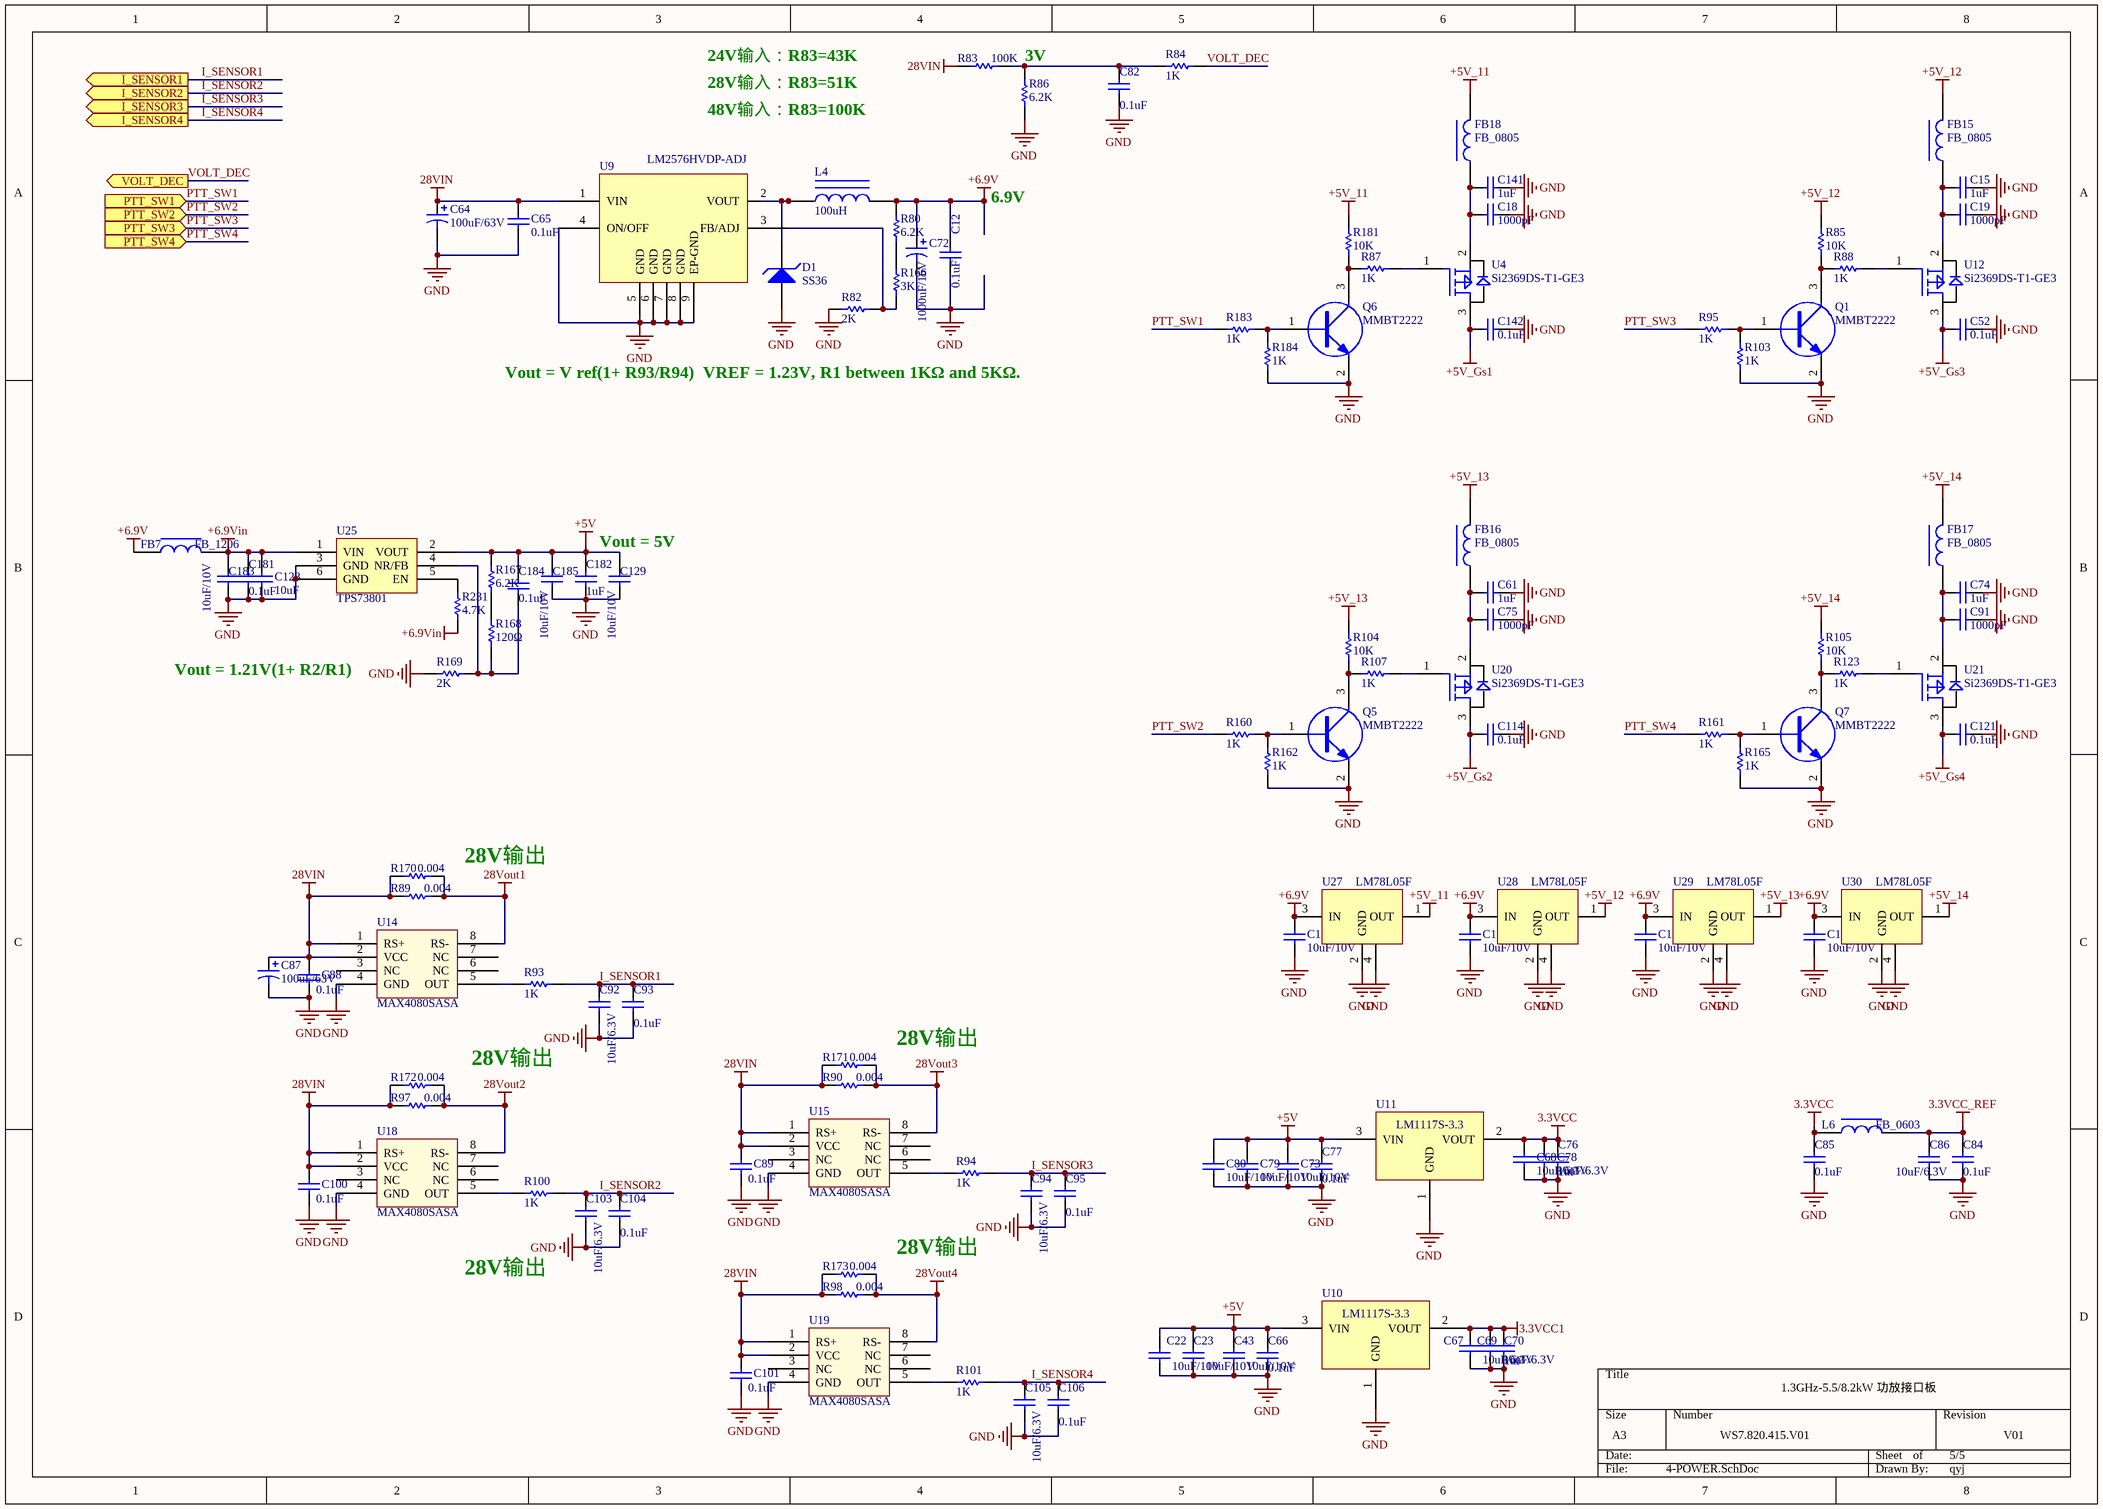
[diagram p3: 4-POWER.SchDoc]

### Parts
C12  0.1uF  [C0603]
C15  1uF  [C0603]
C18  1000pF  [C0603]
C19  1000pF  [C0603]
C22  10uF/10V  [C0805]
C23  10uF/10V  [C0805]
C43  10uF/10V  [C0805]
C52  0.1uF  [C0603]
C61  1uF  [C0603]
C64  100uF/63V  [ECAP2SM_10R4x10R4]
C65  0.1uF  [C0603]
C66  0.1uF  [C0603]
C67  10uF/6.3V  [C0603]
C68  10uF/6.3V  [C0603]
C69  10uF/6.3V  [C0603]
C70  1uF  [C0603]
C72  1000uF/16V  [ECAP2SM_10R4x10R4]
C73  10uF/10V  [C0805]
C74  1uF  [C0603]
C75  1000pF  [C0603]
C76  1uF  [C0603]
C77  0.1uF  [C0603]
C78  10uF/6.3V  [C0603]
C79  10uF/10V  [C0805]
C80  10uF/10V  [C0805]
C82  0.1uF  [C0603]
C84  0.1uF  [C0603]
C85  0.1uF  [C0603]
C86  10uF/6.3V  [C0603]
C87  100uF/63V  [ECAP2SM_10R4x10R4]
C88  0.1uF  [C0603]
C89  0.1uF  [C0603]
C91  1000pF  [C0603]
C92  10uF/6.3V  [C0603]
C93  0.1uF  [C0603]
C94  10uF/6.3V  [C0603]
C95  0.1uF  [C0603]
C100  0.1uF  [C0603]
C101  0.1uF  [C0603]
C103  10uF/6.3V  [C0603]
C104  0.1uF  [C0603]
C105  10uF/6.3V  [C0603]
C106  0.1uF  [C0603]
C114  0.1uF  [C0603]
C121  0.1uF  [C0603]
C128  10uF  [C1210]
C129  10uF/10V  [C0805]
C132  10uF/10V  [C0805]
C133  10uF/10V  [C0805]
C134  10uF/10V  [C0805]
C135  10uF/10V  [C0805]
C141  1uF  [C0603]
C142  0.1uF  [C0603]
C181  0.1uF  [C0603]
C182  1uF  [C0603]
C183  10uF/10V  [C0805]
C184  0.1uF  [C0603]
C185  10uF/10V  [C0805]
D1  SS36  [DO-214AC]
FB7  FB_1206  [L1206]
FB15  FB_0805  [L0805]
FB16  FB_0805  [L0805]
FB17  FB_0805  [L0805]
FB18  FB_0805  [L0805]
L4  100uH  [PL2SM-12R5x12R5]
L6  FB_0603  [L0603]
Q1  MMBT2222  [SOT23-3]
Q5  MMBT2222  [SOT23-3]
Q6  MMBT2222  [SOT23-3]
Q7  MMBT2222  [SOT23-3]
R80  6.2K  [R0603]
R82  2K  [R0603]
R83  100K  [R0603]
R84  1K  [R0603]
R85  10K  [R0603]
R86  6.2K  [R0603]
R87  1K  [R0603]
R88  1K  [R0603]
R89  0.004  [R2512]
R90  0.004  [R2512]
R93  1K  [R0603]
R94  1K  [R0603]
R95  1K  [R0603]
R97  0.004  [R2512]
R98  0.004  [R2512]
R100  1K  [R0603]
R101  1K  [R0603]
R103  1K  [R0603]
R104  10K  [R0603]
R105  10K  [R0603]
R107  1K  [R0603]
R123  1K  [R0603]
R160  1K  [R0603]
R161  1K  [R0603]
R162  1K  [R0603]
R165  1K  [R0603]
R166  3K  [R0603]
R167  6.2K  [R0603]
R168  120Ω  [R0603]
R169  2K  [R0603]
R170  0.004  [R2512]
R171  0.004  [R2512]
R172  0.004  [R2512]
R173  0.004  [R2512]
R181  10K  [R0603]
R183  1K  [R0603]
R184  1K  [R0603]
R231  4.7K  [R0603]
U4  Si2369DS-T1-GE3  [SOT23-3]
U9  LM2576HVDP-ADJ  [SOIC8_1R27_3R9x4R9-1]
U10  LM1117S-3.3  [SOT-223]
U11  LM1117S-3.3  [SOT-223]
U12  Si2369DS-T1-GE3  [SOT23-3]
U14  MAX4080SASA  [SOIC8_1R27_3R9x4R9]
U15  MAX4080SASA  [SOIC8_1R27_3R9x4R9]
U18  MAX4080SASA  [SOIC8_1R27_3R9x4R9]
U19  MAX4080SASA  [SOIC8_1R27_3R9x4R9]
U20  Si2369DS-T1-GE3  [SOT23-3]
U21  Si2369DS-T1-GE3  [SOT23-3]
U25  TPS73801  [SOT-223-6]
U27  LM78L05F  [SOT-89]
U28  LM78L05F  [SOT-89]
U29  LM78L05F  [SOT-89]
U30  LM78L05F  [SOT-89]

### Ports
I_SENSOR1 (out), I_SENSOR2 (out), I_SENSOR3 (out), I_SENSOR4 (out), PTT_SW1 (in), PTT_SW2 (in), PTT_SW3 (in), PTT_SW4 (in), VOLT_DEC (out)

### Nets
3.3VCC: C68.2 C76.2 C78.2 C85.2 L6.1 U11.2(VOUT)
3.3VCC1: C67.2 C69.2 C70.2 U10.2(VOUT)
3.3VCC_REF: C84.2 C86.2 L6.2
28VIN: C64.1 C65.2 C87.1 C88.2 C89.2 C100.2 C101.2 R83.1 R89.1 R90.1 R97.1 R98.1 R170.1 R171.1 R172.1 R173.1 U9.1(VIN) U14.1(RS+) U14.2(VCC) U15.1(RS+) U15.2(VCC) U18.1(RS+) U18.2(VCC) U19.1(RS+) U19.2(VCC)
28Vout1: R89.2 R170.2 U14.8(RS-)
28Vout2: R97.2 R172.2 U18.8(RS-)
28Vout3: R90.2 R171.2 U15.8(RS-)
28Vout4: R98.2 R173.2 U19.8(RS-)
+5V: C22.2 C23.2 C43.2 C66.2 C73.2 C77.2 C79.2 C80.2 C129.2 C182.2 C184.2 C185.2 R167.2 U10.3(VIN) U11.3(VIN) U25.2(VOUT)
+5V_11: FB18.2 R181.2 U27.1(OUT)
+5V_12: FB15.2 R85.2 U28.1(OUT)
+5V_13: FB16.2 R104.2 U29.1(OUT)
+5V_14: FB17.2 R105.2 U30.1(OUT)
+5V_Gs1: C142.2 U4.3(D)
+5V_Gs2: C114.2 U20.3(D)
+5V_Gs3: C52.2 U12.3(D)
+5V_Gs4: C121.2 U21.3(D)
+6.9V: C12.2 C72.1 C132.2 C133.2 C134.2 C135.2 FB7.1 L4.2 R80.2 U27.3(IN) U28.3(IN) U29.3(IN) U30.3(IN)
+6.9Vin: C128.2 C181.2 C183.2 FB7.2 R231.2 U25.1(VIN)
GND: C12.1 C15.1 C18.2 C19.2 C22.1 C23.1 C43.1 C52.1 C61.1 C64.2 C65.1 C66.1 C67.1 C68.1 C69.1 C70.1 C72.2 C73.1 C74.1 C75.2 C76.1 C77.1 C78.1 C79.1 C80.1 C82.1 C84.1 C85.1 C86.1 C87.2 C88.1 C89.1 C91.2 C92.1 C93.1 C94.1 C95.1 C100.1 C101.1 C103.1 C104.1 C105.1 C106.1 C114.1 C121.1 C128.1 C129.1 C132.1 C133.1 C134.1 C135.1 C141.1 C142.1 C181.1 C182.1 C183.1 C185.1 D1.1(A) Q1.2(E) Q5.2(E) Q6.2(E) Q7.2(E) R82.2 R86.1 R103.1 R162.1 R165.1 R169.2 R184.1 U9.4(ON/OFF) U9.5(GND) U9.6(GND) U9.7(GND) U9.8(GND) U9.9(EP-GND) U10.1(GND) U11.1(GND) U14.4(GND) U15.4(GND) U18.4(GND) U19.4(GND) U25.3(GND) U25.6(GND) U27.2(GND) U27.4(GND) U28.2(GND) U28.4(GND) U29.2(GND) U29.4(GND) U30.2(GND) U30.4(GND)
I_SENSOR1: C92.2 C93.2 R93.2 ; port I_SENSOR1
I_SENSOR2: C103.2 C104.2 R100.2 ; port I_SENSOR2
I_SENSOR3: C94.2 C95.2 R94.2 ; port I_SENSOR3
I_SENSOR4: C105.2 C106.2 R101.2 ; port I_SENSOR4
PTT_SW1: R183.1 ; port PTT_SW1
PTT_SW2: R160.1 ; port PTT_SW2
PTT_SW3: R95.1 ; port PTT_SW3
PTT_SW4: R161.1 ; port PTT_SW4
VOLT_DEC: R84.1 ; port VOLT_DEC
NetC15_2: C15.2 C19.1 FB15.1 U12.2(S)
NetC18_1: C18.1 C141.2 FB18.1 U4.2(S)
NetC61_2: C61.2 C75.1 FB16.1 U20.2(S)
NetC74_2: C74.2 C91.1 FB17.1 U21.2(S)
NetC82_2: C82.2 R83.2 R84.2 R86.2
NetC184_1: C184.1 R168.1 R169.1 U25.4(NR/FB)
NetD1_2: D1.2(K) L4.1 U9.2(VOUT)
NetQ1_1: Q1.1(B) R95.2 R103.2
NetQ1_3: Q1.3(C) R85.1 R88.1
NetQ5_1: Q5.1(B) R160.2 R162.2
NetQ5_3: Q5.3(C) R104.1 R107.1
NetQ6_1: Q6.1(B) R183.2 R184.2
NetQ6_3: Q6.3(C) R87.1 R181.1
NetQ7_1: Q7.1(B) R161.2 R165.2
NetQ7_3: Q7.3(C) R105.1 R123.1
NetR80_1: R80.1 R166.2
NetR82_1: R82.1 R166.1 U9.3(FB/ADJ)
NetR87_2: R87.2 U4.1(G)
NetR88_2: R88.2 U12.1(G)
NetR93_1: R93.1 U14.5(OUT)
NetR94_1: R94.1 U15.5(OUT)
NetR100_1: R100.1 U18.5(OUT)
NetR101_1: R101.1 U19.5(OUT)
NetR107_2: R107.2 U20.1(G)
NetR123_2: R123.2 U21.1(G)
NetR167_1: R167.1 R168.2
NetR231_1: R231.1 U25.5(EN)

Not connected (* = marked no-connect by the designer): U14 3(NC) 6(NC) 7(NC); U15 3(NC) 6(NC) 7(NC); U18 3(NC) 6(NC) 7(NC); U19 3(NC) 6(NC) 7(NC)

### Notes on the sheet
- 24V输入：R83=43K
- 28V输入：R83=51K
- (near R86) 3V
- 48V输入：R83=100K
- 6.9V
- Vout = V ref(1+ R93/R94)  VREF = 1.23V, R1 between 1KΩ and 5KΩ.
- Vout = 5V
- Vout = 1.21V(1+ R2/R1)
- 28V输出
- 1.3GHz-5.5/8.2kW 功放接口板
- WS7.820.415.V01
- 5/5
- V01
- qyj

### Library data of the parts
C12 C52 C65 C66 C77 C82 C84 C85 C88 C89 C93 C95 C100 C101 C104 C106 C114 C121 C142 C181 C184 = 0.1uF贴片电容: as C1 on sheet 1-MCU
C15 C61 C70 C74 C76 C141 C182 = 1uF贴片电容: 贴片电容_GRM188R61A105KA61D_1uF±10%,10V,0603; code: 01010038
C18 C19 C75 C91 = 1000pF贴片电容: as C36 on sheet 2-RJ45
C22 C23 C43 C73 C79 C80 C129 C132-C135 C183 C185 = 10uF贴片电容: as C2006 on sheet 3-RF
C64 C87 = 100uF/63V: 贴片电解电容_VEJ101M1JTR-1010_100uF/63V,±20%,表贴D10*H10; code: 01080002
C67-C69 C78 C86 C92 C94 C103 C105 = 10uF贴片电容: as C9 on sheet 1-MCU
C72 = 1000uF/16V: 贴片电解电容_VE102M1CTR-1010_1000uF/16V,±20%,表贴10*10; code: 01080003
C128 = 10uF贴片电容: 贴片电容_GRM32ER71H106KA12L_10uF±10%,50V,1210; code: 03030021
D1 = 肖特基整流二极管_SS36: 肖特基整流二极管_SS36_封装SMA,3A/60V; code: 01040003
FB7 = 1206贴片磁珠: 贴片磁珠_30R,6A,1206; code: 0103015
FB15-FB18 = 0805贴片磁珠: 贴片磁珠_600R,0805; code: 01030023
L4 = 100uH贴片功率电感: 贴片功率电感_SLF12575T-101M1R9-PF_100uH±20%,额定电流1.9A,12.5x12.5; code: 01030003
L6 = 0603贴片磁珠: 贴片磁珠_100R,0603; code: 0103016
Q1 Q5-Q7 = MMBT2222: NPN三极管_MMBT2222_表贴SOT23; code: 01050001
R80 R167 = 6.2K贴片电阻: 贴片电阻_6.2K±5%,0603; code: 01020106
R82 R169 = 2K贴片电阻: 贴片电阻_2K±5%,0603; code: 01020086
R83 = 12.4K贴片电阻: 贴片电阻_12.4K±1%,0603; code: 01020125
R84 R87 R88 R93-R95 R100 R101 R103 R107 R123 R160-R162 R165 R183 R184 = 1K贴片电阻: 贴片电阻_1K±5%,0603; code: 01020082
R85 R104 R105 R181 = 10K贴片电阻: 贴片电阻_10K±5%,0603; code: 01020011
R86 = 1.5K贴片电阻: 贴片电阻_1.5K±5%,0603; code: 01020063
R89 R90 R97 R98 R170-R173 = 0.004Ω检流电阻-标准封装: 贴片电阻_LR12DTDSR004_0.004±5%,2W,2512; code: 01020105
R166 = 3K贴片电阻: 贴片电阻_3K±5%,0603; code: 01020065
R168 = 120Ω贴片电阻: 贴片电阻_120Ω±5%,0603; code: 01020112
R231 = 4.7K贴片电阻: 贴片电阻_4.7K±5%,0603; code: 01020012
U4 U12 U20 U21 = Si2369DS-T1-GE3: P-MOS_Si2369DS-T1-GE3_SOT23; code: 01060087
U9 = LM2576HVDP-ADJ: 稳压集成电路_LM2576HVDP-ADJ_3A输出,SOIC8; code: 03020005; Maker: HTC
U10 U11 = LM1117S-3.3: LDO_LM1117S-3.3_1A输出,SOT223; code: 01060031
U14 U15 U18 U19 = MAX4080TASA: 电流检测放大器_MAX4080SASA_SOIC8; Maker: MAXIM; code: 01060160
U25 = TPS73701DCQ: LDO_TPS73801_1A输出,SOT223-6; Maker: TI; code: 01060111
U27-U30 = LM78L05F: 功率放大器_LM78L05F_5V输出,100mA输出,SOT89; Maker: HTC; code: 03020026

## Nets that join several sheets
3.3VCC: 1-MCU (26 pins), 2-RJ45 (9 pins), 4-POWER (6 pins)
3.3VCC1: 1-MCU (36 pins), 2-RJ45 (J4.10 J4.12), 4-POWER (C67.2 C69.2 C70.2 U10.2)
3.3VCC_REF: 1-MCU (U2.21), 4-POWER (C84.2 C86.2 L6.2)
+5V: 3-RF (22 pins), 4-POWER (16 pins)
+5V_Gs1: 1-MCU (TP17.1), 4-POWER (C142.2 U4.3)
+5V_Gs2: 1-MCU (TP18.1), 4-POWER (C114.2 U20.3)
+5V_Gs3: 1-MCU (TP19.1), 4-POWER (C52.2 U12.3)
+5V_Gs4: 1-MCU (TP20.1), 4-POWER (C121.2 U21.3)
GND: 1-MCU (66 pins), 2-RJ45 (35 pins), 3-RF (38 pins), 4-POWER (91 pins)
I_SENSOR1: 1-MCU (U2.23), 4-POWER (C92.2 C93.2 R93.2)
I_SENSOR2: 1-MCU (U2.24), 4-POWER (C103.2 C104.2 R100.2)
I_SENSOR3: 1-MCU (U2.25), 4-POWER (C94.2 C95.2 R94.2)
I_SENSOR4: 1-MCU (U2.26), 4-POWER (C105.2 C106.2 R101.2)
LINKLED: 1-MCU (R77.2), 2-RJ45 (R50.2 U5.25)
PTT_SW1: 1-MCU (U2.71), 4-POWER (R183.1)
PTT_SW2: 1-MCU (U2.70), 4-POWER (R160.1)
PTT_SW3: 1-MCU (U2.69), 4-POWER (R95.1)
PTT_SW4: 1-MCU (U2.68), 4-POWER (R161.1)
SPI2_MISO: 1-MCU (R17.2), 2-RJ45 (U5.34)
SPI2_MOSI: 1-MCU (R16.2), 2-RJ45 (U5.35)
SPI2_NSS: 1-MCU (R19.2), 2-RJ45 (R41.1 U5.32)
SPI2_SCK: 1-MCU (R18.2), 2-RJ45 (U5.33)
VENV+: 1-MCU (U2.36), 3-RF (C2012.2 C2014.2 R2007.1)
VENV-: 1-MCU (U2.35), 3-RF (C2023.2 C2024.2 R2024.1)
VOLT_DEC: 1-MCU (U2.18), 4-POWER (R84.1)
VRMS+: 1-MCU (U2.34), 3-RF (C2011.2 C2013.2 R2008.2)
VRMS-: 1-MCU (U2.33), 3-RF (C2027.2 C2028.2 R2030.2)
W5500_INTn: 1-MCU (U2.55), 2-RJ45 (U5.36)
W5500_RSTn: 1-MCU (U2.56), 2-RJ45 (R39.1 U5.37)